# Altium project modulo_io.PrjPcb
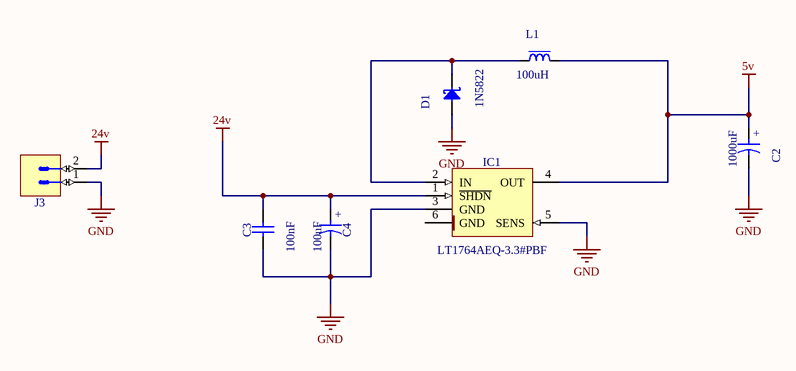
[diagram p0: fonte.SchDoc]
5 sheets, 100 parts. Net scope: flat (ports and power ports of the same name join across sheets).
Board file: modulo_io002.PcbDoc
Sheets:
  fonte.SchDoc
  microcontrolador.SchDoc
  saida_rele.SchDoc
  Input_dig.SchDoc
  comunicacao.SchDoc

## Sheet fonte.SchDoc
size A4

### Parts
C2  1000uF  [CAPPR500-1350X2200]
C3  100nF  [CAPC2012X135N]
C4  100uF  [CAPPR500-1050X1750]
D1  1N5822  [DO-201AD]
IC1  LT1764AEQ-3.3#PBF  [TO170P1394X457-6N-R900X1060]
J3  (no value)  [PHOENIX_1757242]
L1  100uH  [IND_WURTH_WE-PD4_L]

### Nets
5v: C2.1 IC1.4(OUT) L1.2
24v: C3.2 C4.1 IC1.1(~{SHDN}) J3.2
GND: C2.2 C3.1 C4.2 D1.2(A) IC1.3(GND) IC1.5(SENS) J3.1
NetD1_1: D1.1(C) IC1.2(IN) L1.1

Not connected (* = marked no-connect by the designer): IC1 6(GND)

### Notes on the sheet
- (in symbol CAER_100UF_63V_20%_500-1050X1750_LESR0R190) +
- (in symbol CAER_1000UF_35V_20%_VISHAY_MAL203850102E3) +

### Library data of the parts
C2 = CAER_1000UF_35V_20%_VISHAY_MAL203850102E3: Polarised capacitor; Part Description: Radial Standard Ultra Miniature Aluminum Electrolytic Capacitor (038 RSU Series); Manufacturer: VISHAY BCCOMPONENTS; Voltage: 35V; Tolerance: ±20%; Table: Capacitors THD; Part Number: CAER_1000UF_35V_20%_VISHAY_MAL203850102E3; Component Kind: Standard; Component Type: Standard; Pin Count: 2; Value: 1000uF; Status: None; Manufacturer Part Number: MAL203850102E3; Case: LS5 D13.5 x H22; Mounted: Yes; Socket: No; SMD: No; ComponentHeight: 22mm; HelpURL: \\cern.ch\dfs\Applications\Altium\Datasheets\CAER_VISHAY_038 RSU.pdf; Author: CERN DEM JLC; CreateDate: 11/04/2012; LatestRevisionDate: 11/04/2012
C3 = CC0805_100NF_50V_10%_X7R: Non-polarised capacitor; Part Description: SMD Multilayer Chip Ceramic Capacitor; Manufacturer: GENERIC; Manufacturer1 Part Number: B37941K5104K62; Voltage: 50V; TC: X7R; Tolerance: ±10%; Table: Capacitors SMD; Part Number: CC0805_100NF_50V_10%_X7R; Component Kind: Standard; Component Type: Standard; Pin Count: 2; Value: 100nF; Status: Preferred; Manufacturer Part Number: CC0805_100NF_50V_10%_X7R; Case: 0805; Mounted: Yes; Socket: No; SMD: Yes; Manufacturer1 Example: EPCOS; Manufacturer1 ComponentHeight: 1.35mm; HelpURL: \\cern.ch\dfs\Applications\Altium\Datasheets\CC0805_X7R_EPCOS.pdf; Author: CERN DEM JLC; CreateDate: 03/12/2007; LatestRevisionDate: 03/12/2007
C4 = CAER_100UF_63V_20%_500-1050X1750_LESR0R190: Polarised capacitor; Part Description: Low ESR 0R190 Aluminum Electrolytic Capacitor; Manufacturer: VISHAY BCCOMPONENTS; Manufacturer Part Number: MAL213668101E3 Series 136RVI; Voltage: 63V; Tolerance: ±20%; Table: Capacitors THD; Part Number: CAER_100UF_63V_20%_500-1050X1750_LESR0R190; Component Kind: Standard; Component Type: Standard; Pin Count: 2; Value: 100uF; Status: Preferred; Case: LS5 D10.5 x H17.5; Mounted: Yes; Socket: No; SMD: No; ComponentHeight: 17.5mm; HelpURL: \\cern.ch\dfs\Applications\Altium\Datasheets\CAER-LESR_VISHAY_136RVI.pdf; Author: CERN DEM JLC; CreateDate: 03/07/2008; LatestRevisionDate: 16/03/2009
D1 = 1N5822: Schottky Diode; Part Description: Schottky Rectifier; Manufacturer: FAIRCHILD SEMICONDUCTOR; Voltage: 40V; Power: 3A; Table: Diodes; Part Number: 1N5822; Component Kind: Standard; Component Type: Standard; Device: 1N5822; PackageDescription: DO-201AD, Diode, Axial; Lead Spacing 20.32mm, Lead Dia. 1.3mm, Body Length 9.5mm, Body Dia. 5.6mm; Manufacturer Part Number: 1N5822; Pin Count: 2; Case: DO-201AD; Mounted: Yes; Socket: No; SMD: No; ComponentHeight: 5.6mm; HelpURL: \\cern.ch\dfs\Applications\Altium\Datasheets\1N5822.pdf; Author: CERN DEM JLC; CreateDate: 31/03/2009; LatestRevisionDate: 31/03/2009
IC1 = LT1764AEQ-3.3#PBF: 3A, Fast Transient Response, Low Noise, LDO Regulators; Manufacturer: LINEAR TECHNOLOGY; Part Number: LT1764AEQ-3.3#PBF; Component Kind: Standard; Component Type: Standard; Device: LT1764AEQ-3.3#PBF; PackageDescription: TO, 1.70mm Pitch; 5 Pin, 13.945mm L X 8.89mm W X 4.572mm H body, IPC Medium Density; Part Description: 3A, Fast Transient Response, Low Noise, LDO Regulators; Manufacturer Part Number: LT1764AEQ-3.3#PBF; Pin Count: 6; Case: TO-263; Mounted: Yes; Socket: No; SMD: Yes; ComponentHeight: 4.57mm; HelpURL: \\cern.ch\dfs\Applications\Altium\Datasheets\LT1764AEQ-3.3#PBF.pdf; Author: CERN DEM JLC; CreateDate: 27/03/2012; LatestRevisionDate: 27/03/2012; Table: Regulators
J3 = PHOENIX_1757242: Connector 2 Male; Part Description: 12A, 250V, Pitch 5.08mm, 2 Positions Header; Manufacturer: PHOENIX CONTACT; Manufacturer Part Number: 1757242 (MSTBA 2,5/ 2-G-5,08); Part Number: PHOENIX_1757242; Component Kind: Standard; Component Type: Standard; Pin Count: 2; Mounted: Yes; Socket: No; SMD: No; Status: None; ComponentHeight: 8.6mm; HelpURL: \\cern.ch\dfs\Applications\Altium\Datasheets\PHOENIX_1757242.pdf; Author: CERN DEM JLC; CreateDate: 10/02/2010; LatestRevisionDate: 26/04/2010; Table: PHOENIX
L1 = IND_3.3UH_20%_WURTH_WE-PD4_74456033: Inductor With Magnetic core; Part Description: Power Choke (WE-PD 4 Serie); Manufacturer: WURTH ELEKTRONIK; Value: 3.3uH; Power: 5.3A; Resistance: 0.015R; Tolerance: ±20%; Table: Inductors SMD; Part Number: IND_3.3UH_20%_WURTH_WE-PD4_74456033; Component Kind: Standard; Component Type: Standard; Pin Count: 2; Status: None; Manufacturer Part Number: 74456033; Mounted: Yes; Socket: No; SMD: Yes; ComponentHeight: 5.3mm; HelpURL: \\cern.ch\dfs\Applications\Altium\Datasheets\IND_WURTH_WE-PD4_74456033.pdf; Author: CERN DEM JLC; CreateDate: 07/06/2011; LatestRevisionDate: 24/01/2012

## Sheet microcontrolador.SchDoc
size A4
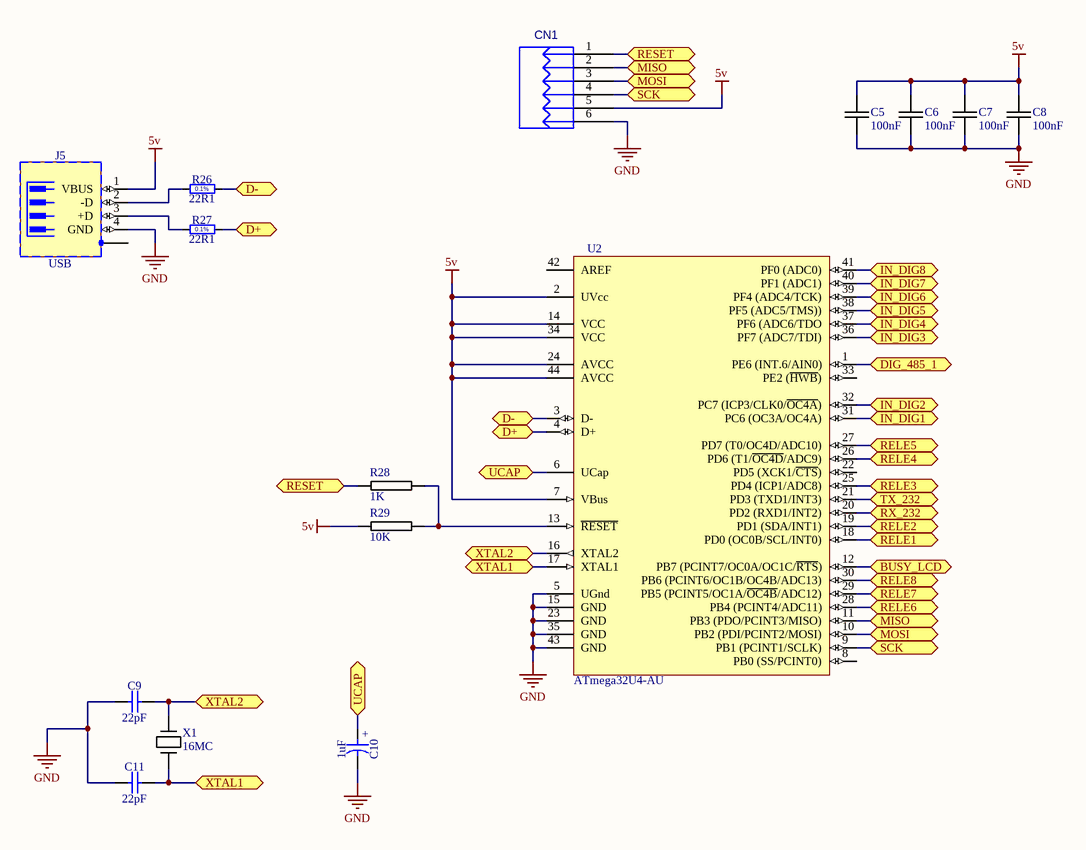
[diagram p1: microcontrolador.SchDoc]

### Parts
C5  100nF  [0805C-TBD]
C6  100nF  [0805C-TBD]
C7  100nF  [0805C-TBD]
C8  100nF  [0805C-TBD]
C9  22pF  [CAPC2012X135N]
C10  1uF  [CAPPRB254-450X710]
C11  22pF  [CAPC2012X135N]
CN1  CONECTOR 2,5 - 6VIAS AMP 880222-6  [CONECTOR 2.5 - 6 VIAS AMP 880222-6]  (value not drawn)
J5  USB  [TYCO_292304-1]
R26  22R1  [RESC2012X60N]
R27  22R1  [RESC2012X60N]
R28  1K  [0805R-1K]
R29  10K  [0805R-10K]
U2  ATmega32U4-AU  [44ML_N]
X1  16MC  [XTAL-RU49/4]

### Ports
BUSY_LCD, D+, D-, DIG_485_1 (bidir), IN_DIG1, IN_DIG2, IN_DIG3, IN_DIG4, IN_DIG5, IN_DIG6, IN_DIG7, IN_DIG8, MISO, MOSI, RELE1, RELE2, RELE3, RELE4, RELE5, RELE6, RELE7, RELE8, RESET, RX_232, SCK, TX_232, UCAP, XTAL1, XTAL2

### Nets
5v: C5.2 C6.2 C7.2 C8.2 CN1.5 J5.1(VBUS) R29.1 U2.2(UVcc) U2.7(VBus) U2.14(VCC) U2.24(AVCC) U2.34(VCC) U2.44(AVCC)
GND: C5.1 C6.1 C7.1 C8.1 C9.1 C10.2 C11.1 CN1.6 J5.4(GND) U2.5(UGnd) U2.15(GND) U2.23(GND) U2.35(GND) U2.43(GND)
NetC9_2: C9.2 U2.16(XTAL2) X1.1 ; port XTAL2
NetC10_1: C10.1 U2.6(UCap) ; port UCAP
NetC11_2: C11.2 U2.17(XTAL1) X1.2 ; port XTAL1
NetCN1_1: CN1.1 R28.1 ; port RESET
NetCN1_2: CN1.2 U2.11(PB3_(PDO/PCINT3/MISO)) ; port MISO
NetCN1_3: CN1.3 U2.10(PB2_(PDI/PCINT2/MOSI)) ; port MOSI
NetCN1_4: CN1.4 U2.9(PB1_(PCINT1/SCLK)) ; port SCK
NetIC2_6: U2.31(PC6_(OC3A/OC4A)) ; port IN_DIG1
NetIC3_6: U2.38(PF5_(ADC5/TMS))) ; port IN_DIG5
NetIC4_6: U2.32(PC7_(ICP3/CLK0/~{OC4A})) ; port IN_DIG2
NetIC5_6: U2.39(PF4_(ADC4/TCK)) ; port IN_DIG6
NetIC6_6: U2.36(PF7_(ADC7/TDI)) ; port IN_DIG3
NetIC7_6: U2.40(PF1_(ADC1)) ; port IN_DIG7
NetIC8_6: U2.37(PF6_(ADC6/TDO) ; port IN_DIG4
NetIC9_6: U2.41(PF0_(ADC0)) ; port IN_DIG8
NetJ2_7: U2.12(PB7_(PCINT7/OC0A/OC1C/~{RTS})) ; port BUSY_LCD
NetJ5_2: J5.2(-D) R26.1
NetJ5_3: J5.3(+D) R27.1
NetR1_1: U2.21(PD3_(TXD1/INT3)) ; port TX_232
NetR6_1: U2.20(PD2_(RXD1/INT2)) ; port RX_232
NetR26_2: R26.2 U2.3(D-) ; port D-
NetR27_2: R27.2 U2.4(D+) ; port D+
NetR28_2: R28.2 R29.2 U2.13(~{RESET})
NetR30_1: U2.18(PD0_(OC0B/SCL/INT0)) ; port RELE1
NetR31_1: U2.19(PD1_(SDA/INT1)) ; port RELE2
NetR32_1: U2.25(PD4_(ICP1/ADC8)) ; port RELE3
NetR33_1: U2.26(PD6_(T1/~{OC4D}/ADC9)) ; port RELE4
NetR34_1: U2.27(PD7_(T0/OC4D/ADC10)) ; port RELE5
NetR35_1: U2.28(PB4_(PCINT4/ADC11)) ; port RELE6
NetR36_1: U2.29(PB5_(PCINT5/OC1A/~{OC4B}/ADC12)) ; port RELE7
NetR37_1: U2.30(PB6_(PCINT6/OC1B/OC4B/ADC13)) ; port RELE8
NetU1_2: U2.1(PE6_(INT.6/AIN0)) ; port DIG_485_1

Not connected (* = marked no-connect by the designer): J5 5(SHIELD); U2 8(PB0_(SS/PCINT0)) 22(PD5_(XCK1/~{CTS})) 33(PE2_(~{HWB})) 42(AREF)

### Notes on the sheet
- (in symbol CTEB_1UF_35V_10%_254-450X710) +
- (in symbol R0805_22R1_0.1%_0.1W_10PPM) 0.1%

### Library data of the parts
C5-C8 = 0805C-100nF-25V-X7R-MUR: CAPACITOR 0805 CERAMIC; Supplier 1: Digi-Key; Supplier Part Number 1: 490-1673-1-ND
C9 C11 = CC0805_22PF_50V_5%_NP0: Non-polarised capacitor; Part Description: SMD Multilayer Chip Ceramic Capacitor; Manufacturer: GENERIC; Manufacturer1 Part Number: 223886115229; Voltage: 50V; TC: NP0; Tolerance: ±5%; Table: Capacitors SMD; Part Number: CC0805_22PF_50V_5%_NP0; Component Kind: Standard; Component Type: Standard; Pin Count: 2; Value: 22pF; Status: Preferred; Manufacturer Part Number: CC0805_22PF_50V_5%_NP0; Case: 0805; Mounted: Yes; Socket: No; SMD: Yes; Manufacturer1 Example: PHYCOMP; Manufacturer1 ComponentHeight: 1.35mm; HelpURL: \\cern.ch\dfs\Applications\Altium\Datasheets\CC0805_NP0_PHYCOMP.pdf; Author: CERN DEM JLC; CreateDate: 03/12/2007; LatestRevisionDate: 03/12/2007
C10 = CTEB_1UF_35V_10%_254-450X710: Polarised capacitor; Part Description: Solid Tantalum Resin Dipped Capacitor; Manufacturer: KEMET; Manufacturer Part Number: T350A105K035AT; Voltage: 35V; Tolerance: ±10%; Table: Capacitors THD; Part Number: CTEB_1UF_35V_10%_254-450X710; Component Kind: Standard; Component Type: Standard; Pin Count: 2; Value: 1uF; Status: None; Case: LS2.54 D4.5 x H7.1; Mounted: Yes; Socket: No; SMD: No; ComponentHeight: 7.1mm; HelpURL: \\cern.ch\dfs\Applications\Altium\Datasheets\CTEB_KEMET_T350.pdf; Author: CERN DEM JLC; CreateDate: 16/12/2009; LatestRevisionDate: 16/12/2009
CN1 = CONECTOR 2,5 - 6VIAS AMP 880222-6: cod: 302003185; 3D comp: CONECTOR 2,5 - 6VIAS AMP 880222-6; Compra: 302003185; Descri: CONECTOR 2,5 - 6VIAS AMP 880222-6; SCH: CONECTOR 2,5 - 6VIAS AMP 880222-6
J5 = TYCO_292304-1: 4 Pin + 1 Shield USB Receptacle; Part Description: Thru Hole, Right Angle, 4 Position, Type B, USB Receptacle; Manufacturer: TYCO ELECTRONICS; Table: TYCO; Part Number: TYCO_292304-1; Component Kind: Standard; Component Type: Standard; Pin Count: 5; Family: USB; Mounted: Yes; Socket: No; SMD: No; Status: None; Manufacturer Part Number: 292304-1; ComponentHeight: 11.5mm; HelpURL: \\cern.ch\dfs\Applications\Altium\Datasheets\TYCO_292304-1.pdf; Author: CERN DEM JLC; CreateDate: 16/07/2010; LatestRevisionDate: 16/07/2010
R26 R27 = R0805_22R1_0.1%_0.1W_10PPM: Resistor - 0.1%; Part Description: Thin Film Chip Resistor; Manufacturer: GENERIC; Manufacturer1 Part Number: RN73C2A22R1BTG; Power: 0.1W; TC: ±10ppm; Table: Resistors SMD; Part Number: R0805_22R1_0.1%_0.1W_10PPM; Component Kind: Standard; Component Type: Standard; Pin Count: 2; Value: 22R1; Status: Not recommended; Tolerance: ±0.1%; Manufacturer Part Number: R0805_22R1_0.1%_0.1W_10PPM; Case: 0805; Mounted: Yes; Socket: No; SMD: Yes; Manufacturer1 Example: TYCO HOLSWORTHY; Manufacturer1 ComponentHeight: 0.6mm; HelpURL: \\cern.ch\dfs\Applications\Altium\Datasheets\R0805_Tyco_RN73.pdf; Author: CERN DEM JLC; CreateDate: 03/12/2007; LatestRevisionDate: 13/03/2008
R28 = 0805R-1K: RESISTOR 0805 1/4 WATT THIN FILM; Reel: *
R29 = 0805R-10K: RESISTOR 0805 1/4 WATT THIN FILM; Reel: *
U2 = ATmega32U4-AU: 8-bit AVR Microcontroller, 2.7-5.5V, 16MHz, 32KB Flash, 1KB EEPROM, 2.5KB SRAM, USB Controller, 44-pin TQFP, Industrial Grade (-40°C to 85°C), Ext Osc; DatasheetVersion: revF, Nov-2010; PackageVersion: rev.G, Jul-2007; PackageReference: 44ML; PackageDescription: 44-Pin Plastic Thin Quad Flat Pack, 10 x 10 x 1.0 mm Body, 0.8 mm Pitch (TQFP); ComponentLink1Description: Manufacturer URL; ComponentLink1URL: http://www.atmel.com/; ComponentLink2Description: ATmega16U4/32U4 Datasheet; ComponentLink2URL: http://www.atmel.com/dyn/resources/prod_documents/doc7766.pdf; ComponentLink3Description: ATmega16U4 ATmega32U4 Summary; ComponentLink3URL: http://www.atmel.com/dyn/resources/prod_documents/7766S.pdf
X1 = 16MC-HC49US: 16MHZ CRSYTAL HC49US; Supplier 1: Mouser; Supplier Part Number 1: 815-ABLS-16.0M-T

## Sheet saida_rele.SchDoc
size A4
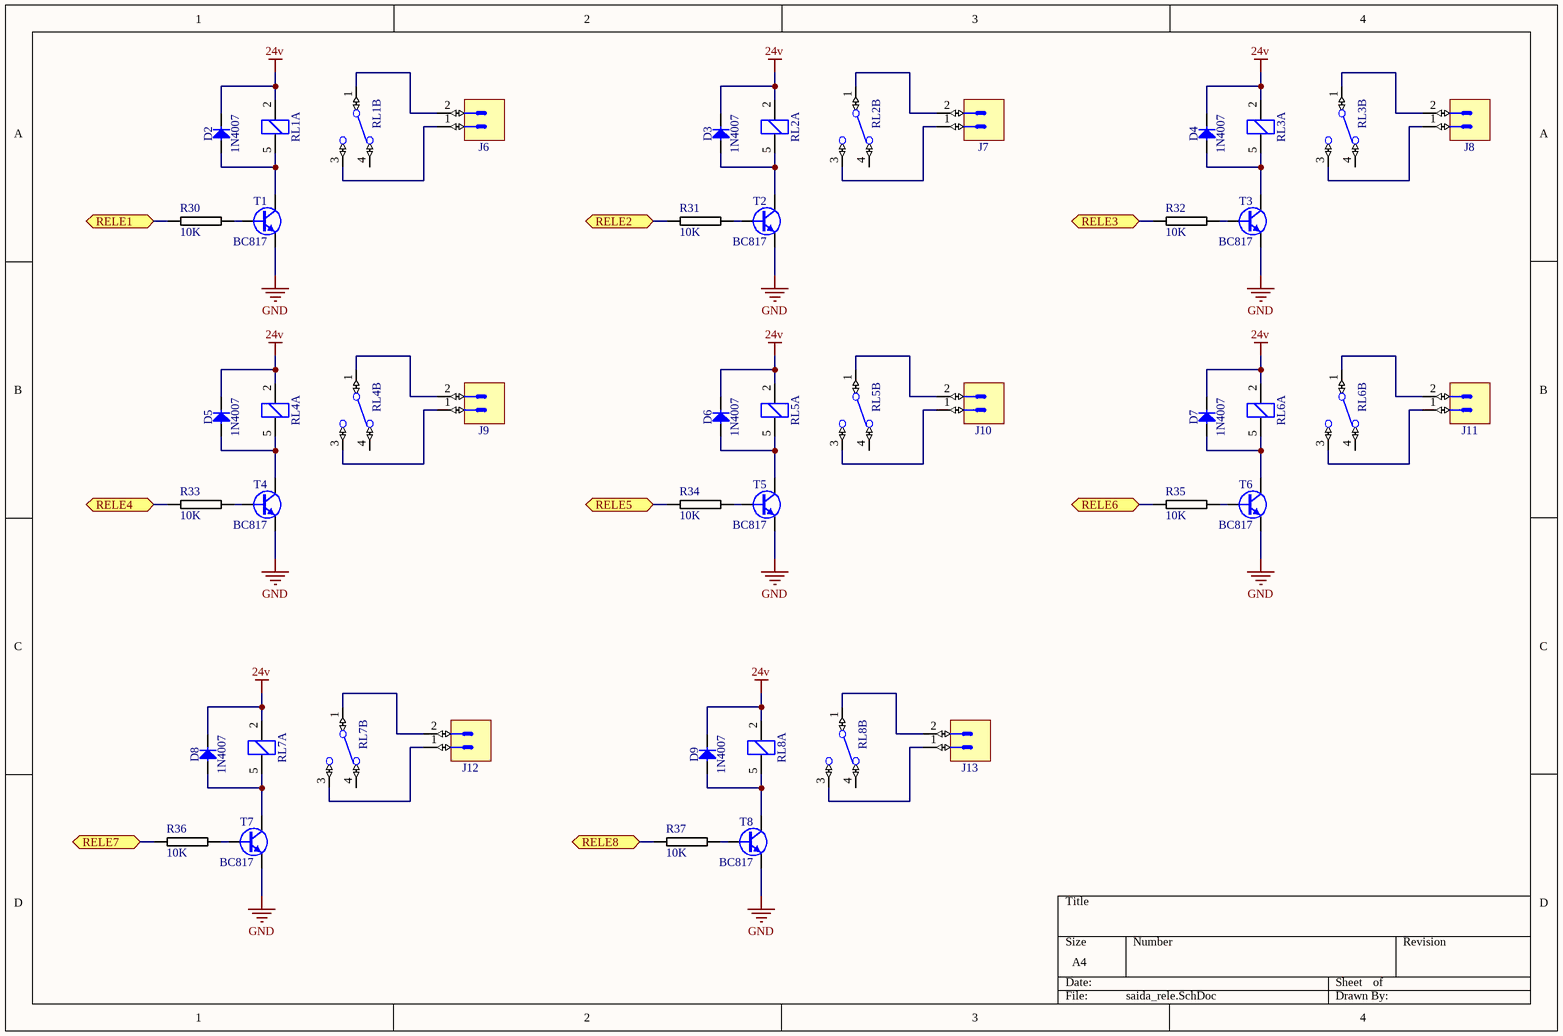
[diagram p2: saida_rele.SchDoc]

### Parts
D2  1N4007  [DO-41]
D3  1N4007  [DO-41]
D4  1N4007  [DO-41]
D5  1N4007  [DO-41]
D6  1N4007  [DO-41]
D7  1N4007  [DO-41]
D8  1N4007  [DO-41]
D9  1N4007  [DO-41]
J6  (no value)  [PHOENIX_1757242]
J7  (no value)  [PHOENIX_1757242]
J8  (no value)  [PHOENIX_1757242]
J9  (no value)  [PHOENIX_1757242]
J10  (no value)  [PHOENIX_1757242]
J11  (no value)  [PHOENIX_1757242]
J12  (no value)  [PHOENIX_1757242]
J13  (no value)  [PHOENIX_1757242]
R30  10K  [0805R-10K]
R31  10K  [0805R-10K]
R32  10K  [0805R-10K]
R33  10K  [0805R-10K]
R34  10K  [0805R-10K]
R35  10K  [0805R-10K]
R36  10K  [0805R-10K]
R37  10K  [0805R-10K]
RL1  5VDC  [REL_PANASONIC_JS1]  (value not drawn)  (parts A,B of 2)
RL2  5VDC  [REL_PANASONIC_JS1]  (value not drawn)  (parts A,B of 2)
RL3  5VDC  [REL_PANASONIC_JS1]  (value not drawn)  (parts A,B of 2)
RL4  5VDC  [REL_PANASONIC_JS1]  (value not drawn)  (parts A,B of 2)
RL5  5VDC  [REL_PANASONIC_JS1]  (value not drawn)  (parts A,B of 2)
RL6  5VDC  [REL_PANASONIC_JS1]  (value not drawn)  (parts A,B of 2)
RL7  5VDC  [REL_PANASONIC_JS1]  (value not drawn)  (parts A,B of 2)
RL8  5VDC  [REL_PANASONIC_JS1]  (value not drawn)  (parts A,B of 2)
T1  BC817  [SOT95P230X110-3N]
T2  BC817  [SOT95P230X110-3N]
T3  BC817  [SOT95P230X110-3N]
T4  BC817  [SOT95P230X110-3N]
T5  BC817  [SOT95P230X110-3N]
T6  BC817  [SOT95P230X110-3N]
T7  BC817  [SOT95P230X110-3N]
T8  BC817  [SOT95P230X110-3N]

### Ports
RELE1, RELE2, RELE3, RELE4, RELE5, RELE6, RELE7, RELE8

### Nets
24v: D2.1(C) D3.1(C) D4.1(C) D5.1(C) D6.1(C) D7.1(C) D8.1(C) D9.1(C) RL1.2(COIL) RL2.2(COIL) RL3.2(COIL) RL4.2(COIL) RL5.2(COIL) RL6.2(COIL) RL7.2(COIL) RL8.2(COIL)
GND: T1.2(E) T2.2(E) T3.2(E) T4.2(E) T5.2(E) T6.2(E) T7.2(E) T8.2(E)
NetD2_2: D2.2(A) RL1.5(COIL) T1.3(C)
NetD3_2: D3.2(A) RL2.5(COIL) T2.3(C)
NetD4_2: D4.2(A) RL3.5(COIL) T3.3(C)
NetD5_2: D5.2(A) RL4.5(COIL) T4.3(C)
NetD6_2: D6.2(A) RL5.5(COIL) T5.3(C)
NetD7_2: D7.2(A) RL6.5(COIL) T6.3(C)
NetD8_2: D8.2(A) RL7.5(COIL) T7.3(C)
NetD9_2: D9.2(A) RL8.5(COIL) T8.3(C)
NetJ6_1: J6.1 RL1.3(NO)
NetJ6_2: J6.2 RL1.1(C)
NetJ7_1: J7.1 RL2.3(NO)
NetJ7_2: J7.2 RL2.1(C)
NetJ8_1: J8.1 RL3.3(NO)
NetJ8_2: J8.2 RL3.1(C)
NetJ9_1: J9.1 RL4.3(NO)
NetJ9_2: J9.2 RL4.1(C)
NetJ10_1: J10.1 RL5.3(NO)
NetJ10_2: J10.2 RL5.1(C)
NetJ11_1: J11.1 RL6.3(NO)
NetJ11_2: J11.2 RL6.1(C)
NetJ12_1: J12.1 RL7.3(NO)
NetJ12_2: J12.2 RL7.1(C)
NetJ13_1: J13.1 RL8.3(NO)
NetJ13_2: J13.2 RL8.1(C)
NetR30_1: R30.1 ; port RELE1
NetR30_2: R30.2 T1.1(B)
NetR31_1: R31.1 ; port RELE2
NetR31_2: R31.2 T2.1(B)
NetR32_1: R32.1 ; port RELE3
NetR32_2: R32.2 T3.1(B)
NetR33_1: R33.1 ; port RELE4
NetR33_2: R33.2 T4.1(B)
NetR34_1: R34.1 ; port RELE5
NetR34_2: R34.2 T5.1(B)
NetR35_1: R35.1 ; port RELE6
NetR35_2: R35.2 T6.1(B)
NetR36_1: R36.1 ; port RELE7
NetR36_2: R36.2 T7.1(B)
NetR37_1: R37.1 ; port RELE8
NetR37_2: R37.2 T8.1(B)

Not connected (* = marked no-connect by the designer): RL1 4(NC); RL2 4(NC); RL3 4(NC); RL4 4(NC); RL5 4(NC); RL6 4(NC); RL7 4(NC); RL8 4(NC)

### Library data of the parts
D2-D9 = 1N4007: Diode; Part Description: Axial Lead Standard Recovery Rectifier; Manufacturer: FAIRCHILD SEMICONDUCTOR; Voltage: 1000V; Power: 1A; Table: Diodes; Part Number: 1N4007; Component Kind: Standard; Component Type: Standard; Device: 1N4007; PackageDescription: DO-41, Diode, Axial, Body 4.7 x 2.7mm (LxDia. Max), Pin spacing 10.16mm; Manufacturer Part Number: 1N4007; Pin Count: 2; Case: DO-41; Mounted: Yes; Socket: No; SMD: No; ComponentHeight: 2.72mm; HelpURL: \\cern.ch\dfs\Applications\Altium\Datasheets\1N4007.pdf; ComponentLink1URL: \\cern.ch\dfs\Applications\Altium\Datasheets\1N4007_Package.pdf; ComponentLink1Description: Package Drawing; Author: CERN DEM JLC; CreateDate: 20/08/2008; LatestRevisionDate: 30/10/2013
J6-J13 = PHOENIX_1757242: as J3 on sheet fonte; Part Number: PHOENIX_1757242; Component Kind: Standard; Component Type: Standard; Pin Count: 2; Mounted: Yes; Socket: No; SMD: No; Status: None; ComponentHeight: 8.6mm; HelpURL: \\cern.ch\dfs\Applications\Altium\Datasheets\PHOENIX_1757242.pdf; Author: CERN DEM JLC; CreateDate: 10/02/2010; LatestRevisionDate: 26/04/2010; Table: PHOENIX
R30-R37 = 0805R-10K: RESISTOR 0805 1/4 WATT THIN FILM; Reel: *
RL1-RL8 = REL_PANASONIC_JS1-5V-F: 10A SPDT PCB Relay, JS Serie; Part Description: 10A/250VAC SPDT (1 Form C) Power Relay, JS Serie; Table: Relays; Part Number: REL_PANASONIC_JS1-5V-F; Component Kind: Standard; Component Type: Standard; Pin Count: 5; PackageDescription: 5 Leads Relay, Row Spacing 12 mm; Body 22mm x 16mm, JS Serie; Mounted: Yes; Socket: No; SMD: No; Status: None; Value: 5VDC; Manufacturer: PANASONIC; Manufacturer Part Number: JS1-5V-F; ComponentHeight: 16.3mm; HelpURL: \\cern.ch\dfs\Applications\Altium\Datasheets\REL_PANASONIC_JS.pdf; Author: CERN DEM JLC; CreateDate: 13/03/2013; LatestRevisionDate: 13/03/2013
T1-T8 = BC817: NPN Transistor; Part Description: 45V 500mA NPN General-Purpose Transistor; Manufacturer: NXP SEMICONDUCTORS; Table: Transistors; Part Number: BC817; Component Kind: Standard; Component Type: Standard; Device: BC817; PackageDescription: SOT23, 3 pin, Pitch 0.95mm - 1.3mm W X 2.9mm L X 1.1mm H, IPC Medium Density; Manufacturer Part Number: BC817; Pin Count: 3; Case: SOT23-3; Mounted: Yes; Socket: No; SMD: Yes; ComponentHeight: 1.1mm; HelpURL: \\cern.ch\dfs\Applications\Altium\Datasheets\BC817.pdf; Author: CERN DEM JLC; CreateDate: 12/05/2011; LatestRevisionDate: 12/05/2011

## Sheet Input_dig.SchDoc
size A4
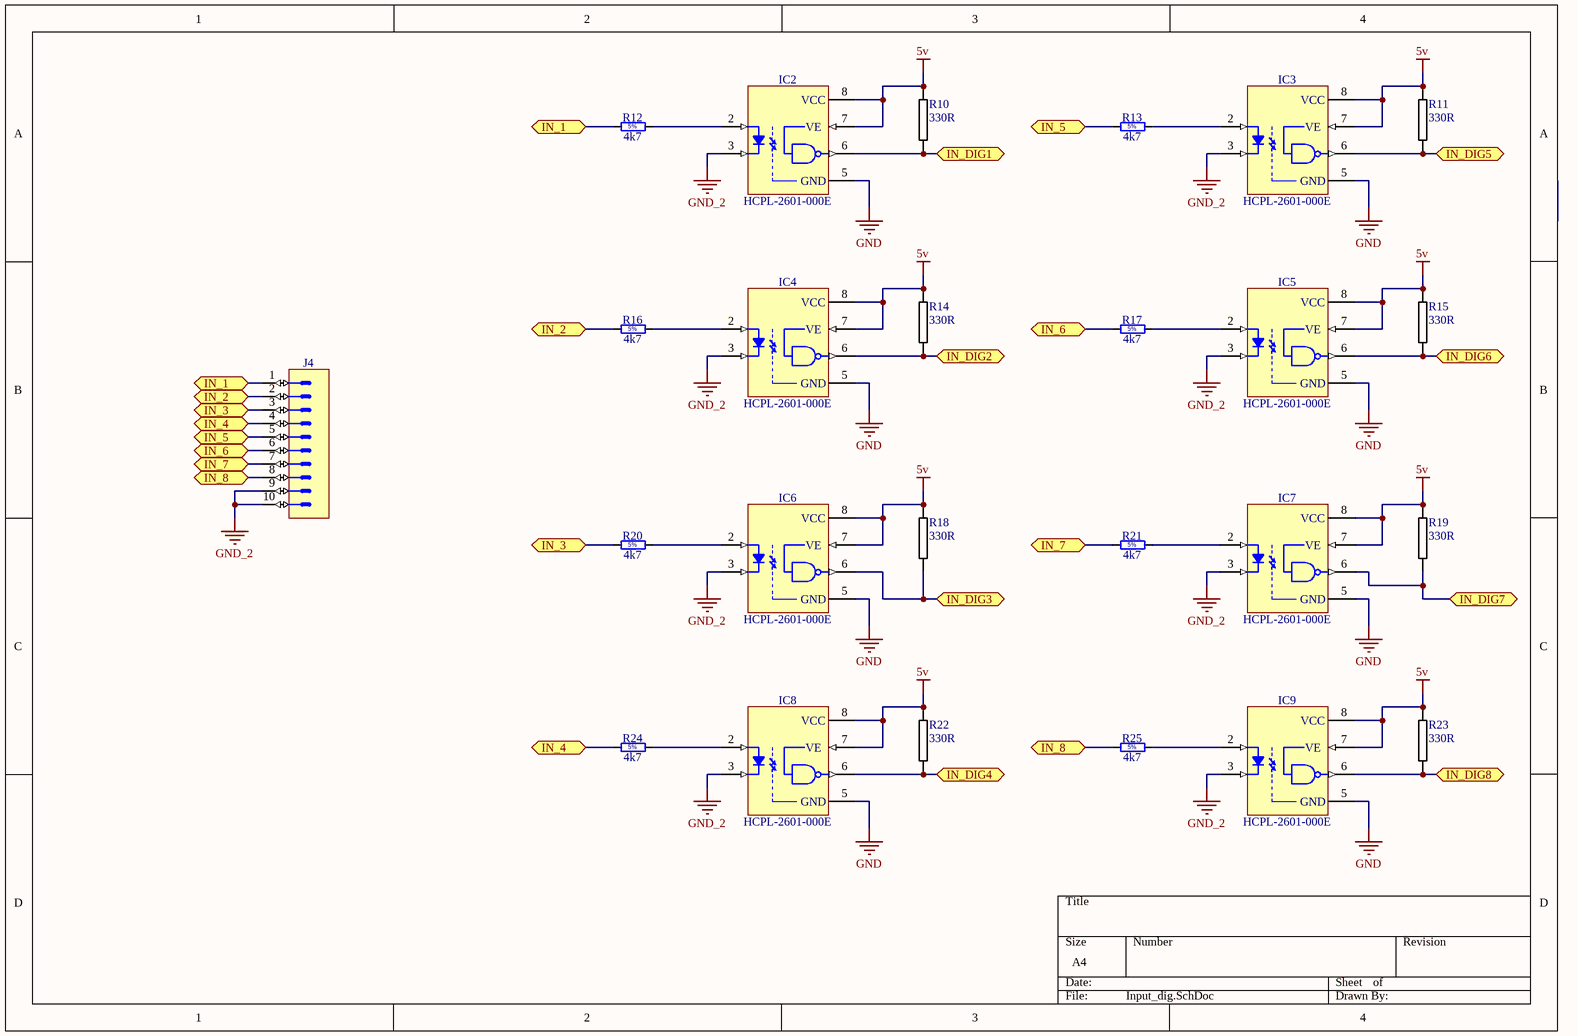
[diagram p3: Input_dig.SchDoc]

### Parts
IC2  HCPL-2601-000E  [DIP8-300]
IC3  HCPL-2601-000E  [DIP8-300]
IC4  HCPL-2601-000E  [DIP8-300]
IC5  HCPL-2601-000E  [DIP8-300]
IC6  HCPL-2601-000E  [DIP8-300]
IC7  HCPL-2601-000E  [DIP8-300]
IC8  HCPL-2601-000E  [DIP8-300]
IC9  HCPL-2601-000E  [DIP8-300]
J4  (no value)  [PHOENIX_1757323]
R10  330R  [0805R-330]
R11  330R  [0805R-330]
R12  4k7  [RES2286-1670X520]
R13  4k7  [RES2286-1670X520]
R14  330R  [0805R-330]
R15  330R  [0805R-330]
R16  4k7  [RES2286-1670X520]
R17  4k7  [RES2286-1670X520]
R18  330R  [0805R-330]
R19  330R  [0805R-330]
R20  4k7  [RES2286-1670X520]
R21  4k7  [RES2286-1670X520]
R22  330R  [0805R-330]
R23  330R  [0805R-330]
R24  4k7  [RES2286-1670X520]
R25  4k7  [RES2286-1670X520]

### Ports
IN_1, IN_2, IN_3, IN_4, IN_5, IN_6, IN_7, IN_8, IN_DIG1, IN_DIG2, IN_DIG3, IN_DIG4, IN_DIG5, IN_DIG6, IN_DIG7, IN_DIG8

### Nets
5v: IC2.7(VE) IC2.8(VCC) IC3.7(VE) IC3.8(VCC) IC4.7(VE) IC4.8(VCC) IC5.7(VE) IC5.8(VCC) IC6.7(VE) IC6.8(VCC) IC7.7(VE) IC7.8(VCC) IC8.7(VE) IC8.8(VCC) IC9.7(VE) IC9.8(VCC) R10.1 R11.1 R14.1 R15.1 R18.1 R19.1 R22.1 R23.1
GND: IC2.5(GND) IC3.5(GND) IC4.5(GND) IC5.5(GND) IC6.5(GND) IC7.5(GND) IC8.5(GND) IC9.5(GND)
GND_2: IC2.3(K) IC3.3(K) IC4.3(K) IC5.3(K) IC6.3(K) IC7.3(K) IC8.3(K) IC9.3(K) J4.9 J4.10
NetIC2_2: IC2.2(A) R12.2
NetIC2_6: IC2.6(VO) R10.2 ; port IN_DIG1
NetIC3_2: IC3.2(A) R13.2
NetIC3_6: IC3.6(VO) R11.2 ; port IN_DIG5
NetIC4_2: IC4.2(A) R16.2
NetIC4_6: IC4.6(VO) R14.2 ; port IN_DIG2
NetIC5_2: IC5.2(A) R17.2
NetIC5_6: IC5.6(VO) R15.2 ; port IN_DIG6
NetIC6_2: IC6.2(A) R20.2
NetIC6_6: IC6.6(VO) R18.2 ; port IN_DIG3
NetIC7_2: IC7.2(A) R21.2
NetIC7_6: IC7.6(VO) R19.2 ; port IN_DIG7
NetIC8_2: IC8.2(A) R24.2
NetIC8_6: IC8.6(VO) R22.2 ; port IN_DIG4
NetIC9_2: IC9.2(A) R25.2
NetIC9_6: IC9.6(VO) R23.2 ; port IN_DIG8
NetJ4_1: J4.1 R12.1 ; port IN_1
NetJ4_2: J4.2 R16.1 ; port IN_2
NetJ4_3: J4.3 R20.1 ; port IN_3
NetJ4_4: J4.4 R24.1 ; port IN_4
NetJ4_5: J4.5 R13.1 ; port IN_5
NetJ4_6: J4.6 R17.1 ; port IN_6
NetJ4_7: J4.7 R21.1 ; port IN_7
NetJ4_8: J4.8 R25.1 ; port IN_8

### Notes on the sheet
- (in symbol RMF_4K7_5%_3W_250PPM_2286-1670X520) 5%

### Library data of the parts
IC2-IC9 = HCPL-2601-000E: Single Optocoupler; Part Description: High CMR, High Speed TTL Compatible Optocouplers; Manufacturer: AVAGO TECHNOLOGIES; Table: Optocouplers; Part Number: HCPL-2601-000E; Component Kind: Standard; Component Type: Standard; Device: HCPL-2601-000E; PackageDescription: DIP; 8 Leads; Row Spacing 7.62 mm; Pitch 2.54 mm; Manufacturer Part Number: HCPL-2601-000E; Pin Count: 8; Case: DIP8-300; Mounted: Yes; Socket: Yes; SMD: No; ComponentHeight: 4.7mm; HelpURL: \\cern.ch\dfs\Applications\Altium\Datasheets\HCPL-2601-000E.pdf; Author: CERN DEM JLC; CreateDate: 30/03/2009; LatestRevisionDate: 30/03/2009
J4 = PHOENIX_1757323: Connector 10 Male; Part Description: 12A, 250V, Pitch 5.08mm, 10 Positions Header; Manufacturer: PHOENIX CONTACT; Manufacturer Part Number: 1757323 (MSTBA 2,5/ 10-G-5,08); Part Number: PHOENIX_1757323; Component Kind: Standard; Component Type: Standard; Pin Count: 10; Mounted: Yes; Socket: No; SMD: No; Status: None; ComponentHeight: 8.6mm; HelpURL: \\cern.ch\dfs\Applications\Altium\Datasheets\PHOENIX_1757323.pdf; Author: CERN DEM JLC; CreateDate: 10/02/2010; LatestRevisionDate: 26/04/2010; Table: PHOENIX
R10 R11 R14 R15 R18 R19 R22 R23 = 0805R-330: RESISTOR 0805 1/4 WATT THIN FILM; Reel: *
R12 R13 R16 R17 R20 R21 R24 R25 = RMF_4K7_5%_3W_250PPM_2286-1670X520: Resistor - 5%; Part Description: Leaded Power Metal Film Resistor; Manufacturer: GENERIC; Manufacturer1 Part Number: PR03000204701JAC00; Power: 3W; TC: ±250ppm/°C; Table: Resistors THD; Part Number: RMF_4K7_5%_3W_250PPM_2286-1670X520; Component Kind: Standard; Component Type: Standard; Pin Count: 2; Value: 4k7; Status: Preferred; Tolerance: ±5%; Manufacturer Part Number: RMF_4K7_5%_3W_250PPM_2286-1670X520; Case: LS22.86 L16.7 x D5.2; Mounted: Yes; Socket: No; SMD: No; ComponentHeight: 5.2mm; Manufacturer1 Example: VISHAY BCCOMPONENT; Manufacturer1 ComponentHeight: 5.2mm; HelpURL: \\cern.ch\dfs\Applications\Altium\Datasheets\RMF_VISHAY_PR03.pdf; Author: CERN DEM JLC; CreateDate: 19/06/2008; LatestRevisionDate: 01/10/2012

## Sheet comunicacao.SchDoc
size A4
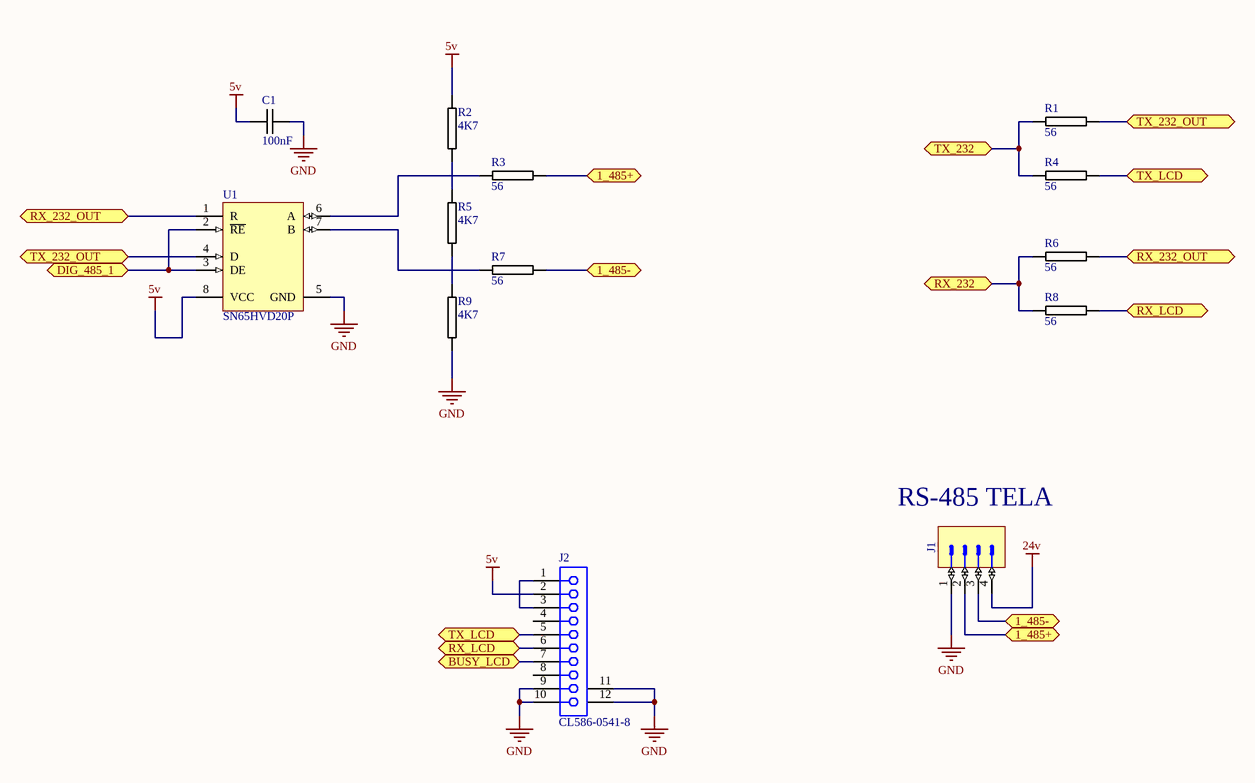
[diagram p4: comunicacao.SchDoc]

### Parts
C1  100nF  [0805C-TBD]
J1  (no value)  [PHOENIX_1757268]
J2  CL586-0541-8  [FH12-22(10)SA-1SH]
R1  56  [0805R-56]
R2  4K7  [0805R-4K7]
R3  56  [0805R-56]
R4  56  [0805R-56]
R5  4K7  [0805R-4K7]
R6  56  [0805R-56]
R7  56  [0805R-56]
R8  56  [0805R-56]
R9  4K7  [0805R-4K7]
U1  SN65HVD20P  [P8]

### Ports
1_485+, 1_485-, BUSY_LCD, DIG_485_1 (bidir), RX_232, RX_232_OUT, RX_LCD, TX_232, TX_232_OUT, TX_LCD

### Nets
5v: C1.1 J2.2 R2.1 U1.8(VCC)
24v: J1.4
GND: C1.2 J1.1 J2.9 J2.10 J2.11(MH1) J2.12(MH2) R9.2 U1.5(GND)
NetJ1_2: J1.2 R3.2 ; port 1_485+
NetJ1_3: J1.3 R7.2 ; port 1_485-
NetJ2_1: J2.1 J2.3
NetJ2_5: J2.5 R4.2 ; port TX_LCD
NetJ2_6: J2.6 R8.2 ; port RX_LCD
NetJ2_7: J2.7 ; port BUSY_LCD
NetR1_1: R1.1 R4.1 ; port TX_232
NetR1_2: R1.2 U1.4(D) ; port TX_232_OUT
NetR2_2: R2.2 R5.1
NetR3_1: R3.1 U1.6(A)
NetR5_2: R5.2 R9.1
NetR6_1: R6.1 R8.1 ; port RX_232
NetR6_2: R6.2 U1.1(R) ; port RX_232_OUT
NetR7_1: R7.1 U1.7(B)
NetU1_2: U1.2(~{RE}) U1.3(DE) ; port DIG_485_1

Not connected (* = marked no-connect by the designer): J2 4 8

### Notes on the sheet
- RS-485 TELA

### Library data of the parts
C1 = 0805C-100nF-25V-X7R-MUR: CAPACITOR 0805 CERAMIC; Supplier 1: Digi-Key; Supplier Part Number 1: 490-1673-1-ND
J1 = PHOENIX_1757268: Connector 4 Male; Part Description: 12A, 250V, Pitch 5.08mm, 4 Positions Header; Manufacturer: PHOENIX CONTACT; Manufacturer Part Number: 1757268 (MSTBA 2,5/ 4-G-5,08); Part Number: PHOENIX_1757268; Component Kind: Standard; Component Type: Standard; Pin Count: 4; Mounted: Yes; Socket: No; SMD: No; Status: None; ComponentHeight: 8.6mm; HelpURL: \\cern.ch\dfs\Applications\Altium\Datasheets\PHOENIX_1757268.pdf; Author: CERN DEM JLC; CreateDate: 10/02/2010; LatestRevisionDate: 26/04/2010; Table: PHOENIX
J2 = CL586-0541-8: FH12 Series, "Flip-Lock" SMT/ZIF FFC/FPC Connector - 1.0mm Spaced Bottom Eccentric Contact; Positions: 10; ContactMaterial: Phosphor Bronze; Current: 0.5A; PCB_Layout: Complies with manufacturer's recommendation.; Note: Pad dimensions follow nominal values, Suitable for Wave Soldering, Adjust for Re-flow.; Published: 17-Jul-2002; DatasheetVersion: 13-Nov-2000; PackageVersion: 13-Nov-2000; PackageReference: FH12-22(10)SA-1SH; Publisher: Altium Limited; ComponentLink1Description: Manufacturer Link; ComponentLink1URL: http://www.hiroseusa.com/; ComponentLink2Description: Datasheet; ComponentLink2URL: http://www.hirose.co.jp/cataloge_hp/e58605370.pdf
R1 R3 R4 R6-R8 = 0805R-56: RESISTOR 0805 1/4 WATT THIN FILM; Reel: *
R2 R5 R9 = 0805R-4K7: RESISTOR 0805 1/4 WATT THIN FILM; Reel: *
U1 = SN65HVD20P: Extended Common-mode RS-485 Transceiver, 25 Mbps, 5 V, Half Duplex, -40 to 85 degC, 8-pin PDIP (P), Pb-Free (RoHS); Manufacturer: Texas Instruments; Eco-Plan: Green (RoHS & no Sb/Br); # of TX/RX: 1 TX / 1 RX; Drivers Per Package: 1; Isolated: No; Number of Nodes: 64; Signaling Rate(Mbps): 25; Common Mode Range: -20 to 25; ESD(kV): 16; Fault Protection(V): -27 to 27; Fail Safe: Idle, Open, Short; ICC(Max)(mA): 9; Supply Voltage(s)(V): 5; Rating: Catalog; DatasheetVersion: SLLS552E; PackageVersion: revE, Apr-2010; PackageReference: P8; PackageDescription: 8-Pin Plastic Dual-In-Line Package, Row Spacing 7.62 mm, Pitch 2.54 mm; Supplier 1: Digi-Key; Supplier Part Number 1: SN65HVD20P-ND; Supplier 2: Mouser; Supplier Part Number 2: 595-SN65HVD20P; SubFamily: RS-485; Receivers Per Package: 1; Duplex: Half; Footprint: SN75176; Mounting Technology: Through-hole; PartNumber: SN65HVD20P; Code_JEDEC: MS-001-BA; ComponentLink1Description: Datasheet; ComponentLink1URL: http://www.ti.com/general/docs/lit/getliterature.tsp?genericPartNumber=SN65HVD20&fileType=pdf; ComponentLink2Description: Package Specification; ComponentLink2URL: http://www.ti.com/litv/pdf/mpdi001b

## Nets that join several sheets
5v: fonte (C2.1 IC1.4 L1.2), microcontrolador (13 pins), Input_dig (24 pins), comunicacao (C1.1 J2.2 R2.1 U1.8)
24v: fonte (C3.2 C4.1 IC1.1 J3.2), saida_rele (16 pins), comunicacao (J1.4)
GND: fonte (7 pins), microcontrolador (14 pins), saida_rele (8 pins), Input_dig (8 pins), comunicacao (8 pins)
NetIC2_6: microcontrolador (U2.31), Input_dig (IC2.6 R10.2)
NetIC3_6: microcontrolador (U2.38), Input_dig (IC3.6 R11.2)
NetIC4_6: microcontrolador (U2.32), Input_dig (IC4.6 R14.2)
NetIC5_6: microcontrolador (U2.39), Input_dig (IC5.6 R15.2)
NetIC6_6: microcontrolador (U2.36), Input_dig (IC6.6 R18.2)
NetIC7_6: microcontrolador (U2.40), Input_dig (IC7.6 R19.2)
NetIC8_6: microcontrolador (U2.37), Input_dig (IC8.6 R22.2)
NetIC9_6: microcontrolador (U2.41), Input_dig (IC9.6 R23.2)
NetJ2_7: microcontrolador (U2.12), comunicacao (J2.7)
NetR1_1: microcontrolador (U2.21), comunicacao (R1.1 R4.1)
NetR6_1: microcontrolador (U2.20), comunicacao (R6.1 R8.1)
NetR30_1: microcontrolador (U2.18), saida_rele (R30.1)
NetR31_1: microcontrolador (U2.19), saida_rele (R31.1)
NetR32_1: microcontrolador (U2.25), saida_rele (R32.1)
NetR33_1: microcontrolador (U2.26), saida_rele (R33.1)
NetR34_1: microcontrolador (U2.27), saida_rele (R34.1)
NetR35_1: microcontrolador (U2.28), saida_rele (R35.1)
NetR36_1: microcontrolador (U2.29), saida_rele (R36.1)
NetR37_1: microcontrolador (U2.30), saida_rele (R37.1)
NetU1_2: microcontrolador (U2.1), comunicacao (U1.2 U1.3)